# Altium schematic sheet Mainboard.SchDoc
size B
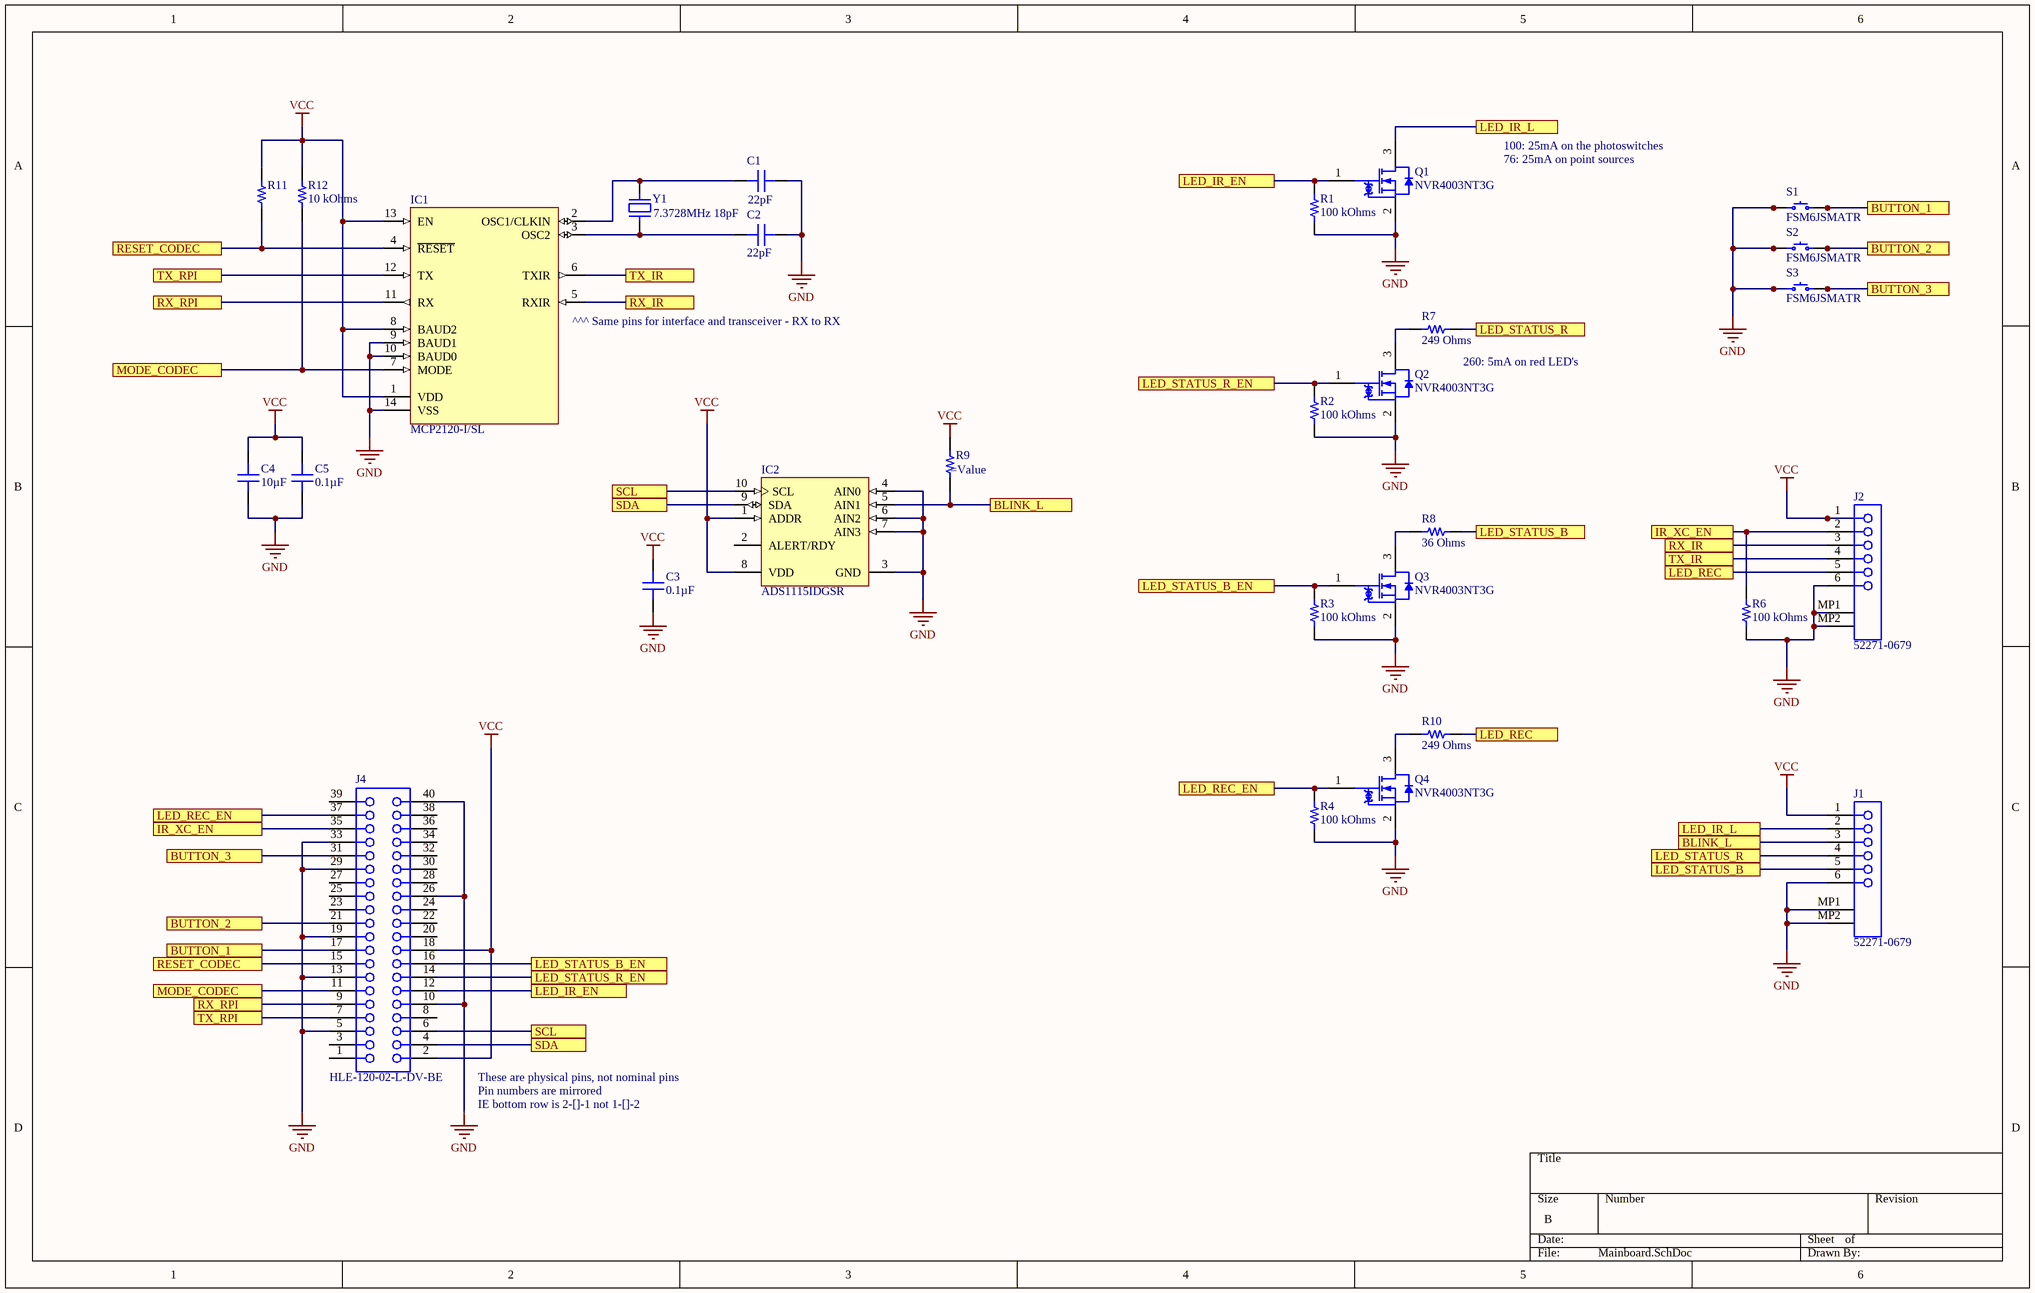
[diagram p0: Mainboard.SchDoc]

## Parts
C1  22pF  [CAP 0603_1608]
C2  22pF  [CAP 0603_1608]
C3  0.1µF  [CAP 0603_1608]
C4  10µF  [CAP 1206_3216 - 1.0MM]
C5  0.1µF  [CAP 0603_1608]
IC1  MCP2120-I/SL  [SOIC-SL14_N]
IC2  ADS1115IDGSR  [TI-DGS10_N]
J1  52271-0679  [MOLX-52271-0679]
J2  52271-0679  [MOLX-52271-0679]
J4  HLE-120-02-L-DV-BE  [SMTC-HLE-120-02-X-DV-BE]
Q1  NVR4003NT3G  [ONSC-SOT-23-3-318-08_V]
Q2  NVR4003NT3G  [ONSC-SOT-23-3-318-08_V]
Q3  NVR4003NT3G  [ONSC-SOT-23-3-318-08_V]
Q4  NVR4003NT3G  [ONSC-SOT-23-3-318-08_V]
R1  100 kOhms  [RES 0603_1608]
R2  100 kOhms  [RES 0603_1608]
R3  100 kOhms  [RES 0603_1608]
R4  100 kOhms  [RES 0603_1608]
R6  100 kOhms  [RES 0603_1608]
R7  249 Ohms  [RES 0603_1608]
R8  36 Ohms  [RES 0603_1608]
R9  (no value)  [RES 0603_1608]
R10  249 Ohms  [RES 0603_1608]
R11  (no value)  [RES 0603_1608]
R12  10 kOhms  [RES 0603_1608]
S1  FSM6JSMATR  [TE FSM6JSMA]
S2  FSM6JSMATR  [TE FSM6JSMA]
S3  FSM6JSMATR  [TE FSM6JSMA]
Y1  7.3728MHz 18pF  [HC-49 PTH]

## Ports
BLINK_L, BUTTON_1, BUTTON_2, BUTTON_3, IR_XC_EN, LED_IR_EN, LED_IR_L, LED_REC, LED_REC_EN, LED_STATUS_B, LED_STATUS_B_EN, LED_STATUS_R, LED_STATUS_R_EN, MODE_CODEC, RESET_CODEC, RX_IR, RX_RPI, SCL, SDA, TX_IR, TX_RPI

## Nets
GND: C1.2 C2.2 C3.1 C4.1 C5.1 IC1.9(BAUD1) IC1.10(BAUD0) IC1.14(VSS) IC2.3(GND) IC2.4(AIN0) IC2.6(AIN2) IC2.7(AIN3) J1.6 J1.MP1 J1.MP2 J2.6 J2.MP1 J2.MP2 J4.5 J4.10 J4.13 J4.19 J4.26 J4.29 J4.33 J4.40 Q1.2(S) Q2.2(S) Q3.2(S) Q4.2(S) R1.1 R2.1 R3.1 R4.1 R6.1 S1.1 S1.2 S2.1 S2.2 S3.1 S3.2
VCC: C3.2 C4.2 C5.2 IC1.1(VDD) IC1.8(BAUD2) IC1.13(EN) IC2.1(ADDR) IC2.8(VDD) J1.1 J2.1 J4.2 J4.18 R9.2 R11.2 R12.2
BLINK_L: IC2.5(AIN1) J1.3 R9.1 ; port BLINK_L
BUTTON_1: J4.17 S1.3 S1.4 ; port BUTTON_1
BUTTON_2: J4.21 S2.3 S2.4 ; port BUTTON_2
BUTTON_3: J4.31 S3.3 S3.4 ; port BUTTON_3
IR_XC_EN: J2.2 J4.35 R6.2 ; port IR_XC_EN
LED_IR_EN: J4.12 Q1.1(G) R1.2 ; port LED_IR_EN
LED_IR_L: J1.2 Q1.3(D) ; port LED_IR_L
LED_REC: J2.5 R10.2 ; port LED_REC
LED_REC_EN: J4.37 Q4.1(G) R4.2 ; port LED_REC_EN
LED_STATUS_B: J1.5 R8.2 ; port LED_STATUS_B
LED_STATUS_B_EN: J4.16 Q3.1(G) R3.2 ; port LED_STATUS_B_EN
LED_STATUS_R: J1.4 R7.2 ; port LED_STATUS_R
LED_STATUS_R_EN: J4.14 Q2.1(G) R2.2 ; port LED_STATUS_R_EN
MODE_CODEC: IC1.7(MODE) J4.11 R12.1 ; port MODE_CODEC
RESET_CODEC: IC1.4(~{RESET}) J4.15 R11.1 ; port RESET_CODEC
RX_IR: IC1.5(RXIR) J2.3 ; port RX_IR
RX_RPI: IC1.11(RX) J4.9 ; port RX_RPI
SCL: IC2.10(SCL) J4.6 ; port SCL
SDA: IC2.9(SDA) J4.4 ; port SDA
TX_IR: IC1.6(TXIR) J2.4 ; port TX_IR
TX_RPI: IC1.12(TX) J4.7 ; port TX_RPI
NetC1_1: C1.1 IC1.2(OSC1/CLKIN) Y1.2
NetC2_1: C2.1 IC1.3(OSC2) Y1.1
NetQ2_3: Q2.3(D) R7.1
NetQ3_3: Q3.3(D) R8.1
NetQ4_3: Q4.3(D) R10.1

Not connected (* = marked no-connect by the designer): IC2 2(ALERT/RDY); J4 1 3 8 20 22 23 24 25 27 28 30 32 34 36 38 39

## Notes on the sheet
- 100: 25mA on the photoswitches
- 76: 25mA on point sources
- (near IC1) ^^^ Same pins for interface and transceiver - RX to RX
- (near R7) 260: 5mA on red LED's
- These are physical pins, not nominal pins
- Pin numbers are mirrored
- IE bottom row is 2-[]-1 not 1-[]-2

## Library data of the parts
C1 C2 = 885012006019: CAP CER 22PF 16V C0G/NP0 0603; Manufacturer: Würth Elektronik; Temperature Coefficient: C0G, NP0; Tolerance: ±5%; Part Number: 885012006019; Value: 22pF; Applications: General Purpose; Capacitance: 22pF; ComponentLink1Description: Datasheet; ComponentLink1URL: https://katalog.we-online.de/pbs/datasheet/885012006019.pdf; ComponentLink2Description: DigiKey Link; ComponentLink2URL: http://digikey.com/product-detail/en/w-rth-elektronik/885012006019/732-7762-1-ND/5454389; Device Package: 0603 (1608 Metric); LastUpdated: 1/21/2020 12:01:39 AM; Lifecycle Status: Active; Minimum Order: 1; Mounting Type: Surface Mount, MLCC; Operating Temperature: -55°C ~ 125°C; Package / Case: 0603 (1608 Metric); Packaging: TapeAndReel; PartId: 17577; Part Status: Active; Price: 0.02; Series: WCAP-CSGP; Size / Dimension: 0.063" L x 0.031" W (1.60mm x 0.80mm); Supplier 1: DigiKey; Supplier Part Number 1: 732-7762-1-ND; Thickness (Max): 0.034" (0.87mm); Voltage - Rated: 16V
C3 C5 = C0603C104K5RAC7411: CAP CER 0.1UF 50V X7R 0603; Manufacturer: KEMET; Tolerance: ±10%; Part Number: C0603C104K5RAC7411; Value: 0.1µF; Applications: Bypass, Decoupling; Capacitance: 0.1µF; ComponentLink1Description: Datasheet; ComponentLink1URL: https://api.kemet.com/component-edge/download/datasheet/C0603C104K5RAC7411.pdf; ComponentLink2Description: DigiKey Link; ComponentLink2URL: http://digikey.com/product-detail/en/kemet/C0603C104K5RAC7411/399-7374-2-ND/3317013; Device Package: 0603 (1608 Metric); LastUpdated: 1/21/2020 12:02:09 AM; Lifecycle Status: Active; Minimum Order: 15000; Mounting Type: Surface Mount, MLCC; Operating Temperature: -55°C ~ 125°C; Package / Case: 0603 (1608 Metric); Packaging: TapeAndReel; PartId: 2233; Part Status: Active; Price: 0.02; Series: SMD Comm X7R; Size / Dimension: 0.063" L x 0.031" W (1.60mm x 0.80mm); Supplier 1: DigiKey; Supplier Part Number 1: 399-7374-2-ND; Temperature Coefficient: X7R; Thickness (Max): 0.035" (0.90mm); Voltage - Rated: 50V
C4 = EMK316BJ106MD-T: CAP CER 10UF 16V X5R 1206; Manufacturer: Taiyo Yuden; Tolerance: ±20%; Part Number: EMK316BJ106MD-T; Value: 10µF; Applications: General Purpose; Capacitance: 10µF; ComponentLink1Description: Datasheet; ComponentLink1URL: http://www.yuden.co.jp/productdata/catalog/mlcc06_e.pdf; ComponentLink2Description: DigiKey Link; ComponentLink2URL: http://digikey.com/product-detail/en/taiyo-yuden/EMK316BJ106MD-T/587-4881-1-ND/6563724; Device Package: 1206 (3216 Metric); LastUpdated: 1/21/2020 12:03:23 AM; Lifecycle Status: Active; Minimum Order: 1; Mounting Type: Surface Mount, MLCC; Operating Temperature: -55°C ~ 85°C; Package / Case: 1206 (3216 Metric); Packaging: TapeAndReel; PartId: 18996; Part Status: Active; Price: 0.05; Series: M; Size / Dimension: 0.126" L x 0.063" W (3.20mm x 1.60mm); Supplier 1: DigiKey; Supplier Part Number 1: 587-4881-1-ND; Temperature Coefficient: X5R; Thickness (Max): 0.037" (0.95mm); Voltage - Rated: 16V
IC1 = MCP2120-I/SL: Infrared Encoder/Decoder, 14-Pin SOIC, Industrial Temperature; Manufacturer: Microchip; DatasheetVersion: revB, Feb-2007; PackageVersion: revBB, Aug-2009; PackageReference: SOIC-SL14; PackageDescription: 14-Lead Plastic Small Outline (SL) - Narrow, 3.90mm Body [SOIC]; Supplier 1: Digi-Key; Supplier Part Number 1: MCP2120-I/SL-ND; Supplier 2: Farnell; Supplier Part Number 2: 1084305; Supplier 3: Newark; Supplier Part Number 3: 33C0867; Supplier 4: Mouser; Supplier Part Number 4: 579-MCP2120ISL; Mounting Technology: Surface Mount; Code_JEDEC: MS-012-AB; Code_IPC: SOIC127P600-14; PartNumber: MCP2120-I/SL; ComponentLink1Description: Manufacturer URL; ComponentLink1URL: http://www.microchip.com/; ComponentLink2Description: Datasheet; ComponentLink2URL: http://ww1.microchip.com/downloads/en/DeviceDoc/21618b.pdf; ComponentLink3Description: Package Specification; ComponentLink3URL: http://www.microchip.com/stellent/groups/techpub_sg/documents/packagingspec/en012702.pdf
IC2 = ADS1115IDGSR: 16-Bit ADC with Integrated Multiplexer, PGA, Comparator, Oscillator, and Reference, -40 to 125 degC, 10-pin SOP (DGS10), Green (RoHS & no Sb/Br); Manufacturer: Texas Instruments; # Input Channels: 4; Analog Voltage AV/DD(Max)(V): 5.5; Analog Voltage AV/DD(Min)(V): 2; Architecture: Delta-Sigma; INL(Max)(+/-LSB): 1; Interface: Serial I2C; Resolution(Bits): 16; Sample Rate (max)(SPS): 860; SubFamily: Precision ADC (<=10MSPS); DatasheetVersion: SBAS444B; PackageVersion: 4073272/C, 02/2004; PackageReference: DGS10; PackageDescription: 10-Pin Plastic Small Outline, Body 3 x 3 mm, Pitch 0.5 mm; Supplier 1: Digi-Key; Supplier Part Number 1: 296-13060-2-ND; Supplier 2: Digi-Key; Supplier Part Number 2: 296-13060-1-ND; Supplier 3: Digi-Key; Supplier Part Number 3: 296-13060-6-ND; Supplier 4: Newark; Supplier Part Number 4: 74C7007; Supplier 5: Mouser; Supplier Part Number 5: 595-ADS1253E/2K5; Digital Supply(Max)(V): 5.5; Digital Supply(Min)(V): 2; Eco-Plan: Green (RoHS & no Sb/Br); Mounting Technology: Surface Mount; Code_JEDEC: MO-153; PartNumber: ADS1115IDGSR; ComponentLink1Description: Manufacturer URL; ComponentLink1URL: http://www.ti.com/; ComponentLink2Description: Datasheet; ComponentLink2URL: http://www.ti.com/general/docs/lit/getliterature.tsp?genericPartNumber=ADS1115&fileType=pdf; ComponentLink3Description: Package Specification; ComponentLink3URL: http://www.ti.com/lit/ml/mpds035b/mpds035b.pdf
J1 J2 = 52271-0679: 1.0 mm Pitch Easy-On(TM) Type FPC Connector, 3.0 mm Mated Height, Right Angle, ZIF, SMT, Bottom Contact, 6 Circuits, -40 to 85 degC, ELV and RoHS Compliant, Tape and Reel; Manufacturer: Molex; Circuits (Loaded): 6; Current (Max per Contact): 0.5A; Durability (mating cycles max): 30; Entry Angle: 90degrees Angle; Mated Height: 3.00mm; Material - Metal: Phosphor Bronze; Material - Plating Mating: Tin-Bismuth; PCB Locator: No; PCB Retention: Yes; Pitch - Mating Interface: 1.00mm; Voltage (Max): 50V AC (RMS)/DC; PackageVersion: Rev. B, 04/2004; PackageReference: 52271-0679; PackageDescription: 6-Lead FPC Connector, Pitch 1.0 mm; Supplier 1: Farnell; Supplier Part Number 1: 1079950; Supplier 2: Newark; Supplier Part Number 2: 58J9529; Supplier 3: Mouser; Supplier Part Number 3: 538-52271-0679; Contact Position: Bottom; Material - Plating Termination: Tin-Bismuth; Number of Rows: 1; Orientation: Right Angle; Packing: Tape and Reel; Pitch - Termination Interface: 1.00mm; Polarized to PCB: Yes; RoHS: TRUE; Stackable: No; Mounting Technology: Surface Mount; PartNumber: 52271-0679; ComponentLink1Description: Manufacturer URL; ComponentLink1URL: http://www.molex.com/molex/index.jsp; ComponentLink2Description: Datasheet; ComponentLink2URL: http://www.molex.com/webdocs/datasheets/pdf/en-us/0522710679_FFC_FPC_CONNECTORS.pdf; ComponentLink3Description: Package Specification; ComponentLink3URL: http://www.molex.com/pdm_docs/sd/522710679_sd.pdf; System: Connector
J4 = HLE-120-02-L-DV-BE: Cost-Effective Reliable Socket, Surface Mount, Vertical, -55 to 125 degC, 2.54 mm Pitch, 40-Pin, Female, RoHS; Manufacturer: Samtec; Pitch: 2.54 mm; DatasheetVersion: F-214; PackageVersion: AQ, 12/1998; PackageReference: HLE-120-02-X-DV-BE; PackageDescription: .100 Tiger Beam Socket Assembly; Orientation: Vertical; RoHS: True; Temperature Range: -55 to 125 degC; Mounting Technology: Surface Mount; PartNumber: HLE-120-02-L-DV-BE; ComponentLink1Description: Manufacturer URL; ComponentLink1URL: http://www.samtec.com; ComponentLink2Description: Datasheet; ComponentLink2URL: http://www.samtec.com/documents/webfiles/pdf/HLE.PDF; ComponentLink3Description: Package Specification; ComponentLink3URL: http://www.samtec.com/documents/webfiles/cpdf/HLE-1XX-02-XXX-DV-XX-XX-XX-MKT.pdf
Q1-Q4 = NVR4003NT3G: Small Signal MOSFET, 30 V, 0.56 A, Single N-Channel, 3-Pin SOT-23, Pb-Free, Tape and Reel; Manufacturer: On Semiconductor; Channel Polarity: N Channel; Ciss Typ (pF): 21; Coss Typ (pF): 19.7; Crss Typ (pF): 8.1; ID Max (A): 0.56; V(BR)DSS Min (V): 30; VGS Max (V): 20; VGS(th) Max (V): 1.4; DatasheetVersion: Rev. 3; PackageVersion: Rev. AP, 11/2009; PackageReference: SOT-23-3-318-08; PackageDescription: 3-Pin Small Outline Transistor, Body 2.92 x 1.3 mm, Pitch 0.95 mm; Supplier 1: Digi-Key; Supplier Part Number 1: NVR4003NT3G-ND; Supplier 2: Newark; Supplier Part Number 2: 76T6792; Supplier 3: Mouser; Supplier Part Number 3: 863-NVR4003NT3G; Configuration: Single; Package Type: SOT-23-3; Packing: Tape and Reel; RoHS: Pb-Free; Mounting Technology: Surface Mount; PartNumber: NVR4003NT3G; ComponentLink1Description: Manufacturer URL; ComponentLink1URL: http://www.onsemi.com/; ComponentLink2Description: Datasheet; ComponentLink2URL: http://www.onsemi.cn/pub_link/Collateral/NTR4003N-D.PDF; ComponentLink3Description: Package Specification; ComponentLink3URL: http://www.onsemi.cn/pub_link/Collateral/318-08.PDF
R1-R4 R6 = CPF0603B100KE: RES SMD 100K OHM 0.1% 1/16W 0603; Manufacturer: TE Connectivity Passive Product; Power (Watts): 0.063W, 1/16W; Temperature Coefficient: ±25ppm/°C; Part Number: CPF0603B100KE; Value: 100 kOhms; ComponentLink1Description: Datasheet; ComponentLink1URL: https://www.te.com/commerce/DocumentDelivery/DDEController?Action=srchrtrv&DocNm=1773200&DocType=DS&DocLang=English; ComponentLink2Description: DigiKey Link; ComponentLink2URL: http://digikey.com/product-detail/en/te-connectivity-passive-product/CPF0603B100KE/A119912CT-ND/4966510; Composition: Thin Film; Device Package: 0603 (1608 Metric); Height - Seated (Max): 0.022" (0.55mm); LastUpdated: 1/21/2020 12:24:55 AM; Lifecycle Status: Active; Minimum Order: 1; Number of Terminations: 2; Operating Temperature: -55°C ~ 155°C; Package / Case: 0603 (1608 Metric); Packaging: TapeAndReel; PartId: 4883; Part Status: Active; Price: 0.09; Resistance: 100 kOhms; Series: CPF, Neohm; Size / Dimension: 0.061" L x 0.031" W (1.55mm x 0.80mm); Supplier 1: DigiKey; Supplier Part Number 1: A119912CT-ND; Supplier Device Package: 0603; Tolerance: ±0.1%
R7 R10 = ERJ-3EKF2490V: RES SMD 249 OHM 1% 1/10W 0603; Manufacturer: Panasonic Electronic Components; Power (Watts): 0.1W, 1/10W; Temperature Coefficient: ±100ppm/°C; Part Number: ERJ-3EKF2490V; Value: 249 Ohms; ComponentLink1Description: Datasheet; ComponentLink1URL: https://industrial.panasonic.com/cdbs/www-data/pdf/RDA0000/AOA0000C304.pdf; ComponentLink2Description: DigiKey Link; ComponentLink2URL: http://digikey.com/product-detail/en/panasonic-electronic-components/ERJ-3EKF2490V/P249HCT-ND/198274; Composition: Thick Film; Device Package: 0603 (1608 Metric); Features: Automotive AEC-Q200; Height - Seated (Max): 0.022" (0.55mm); LastUpdated: 1/21/2020 12:14:40 AM; Lifecycle Status: Active; Minimum Order: 1; Number of Terminations: 2; Operating Temperature: -55°C ~ 155°C; Package / Case: 0603 (1608 Metric); Packaging: TapeAndReel; PartId: 26079; Part Status: Active; Price: 0.01; Ratings: AEC-Q200; Resistance: 249 Ohms; Series: ERJ; Size / Dimension: 0.063" L x 0.031" W (1.60mm x 0.80mm); Supplier 1: DigiKey; Supplier Part Number 1: P249HCT-ND; Supplier Device Package: 0603; Tolerance: ±1%
R8 = RK73H1JTTD36R0F: RES 36 OHM 1% 1/8W 0603; Manufacturer: KOA Speer Electronics, Inc.; Power (Watts): 0.125W, 1/8W; Temperature Coefficient: ±100ppm/°C; Part Number: RK73H1JTTD36R0F; Value: 36 Ohms; ComponentLink1Description: Datasheet; ComponentLink1URL: http://www.koaspeer.com/catimages/Products/RK73H/RK73H.pdf; ComponentLink2Description: DigiKey Link; ComponentLink2URL: http://digikey.com/product-detail/en/koa-speer-electronics-inc/RK73H1JTTD36R0F/2019-RK73H1JTTD36R0FCT-ND/9847473; Composition: Thick Film; Device Package: 0603 (1608 Metric); Features: Automotive AEC-Q200, Moisture Resistant; Height - Seated (Max): 0.022" (0.55mm); LastUpdated: 1/21/2020 12:23:23 AM; Lifecycle Status: Active; Minimum Order: 1; Number of Terminations: 2; Operating Temperature: -55°C ~ 155°C; Package / Case: 0603 (1608 Metric); Packaging: CutTape; PartId: 8854; Part Status: Active; Price: 0.10; Ratings: AEC-Q200; Resistance: 36 Ohms; Series: RK73H; Size / Dimension: 0.063" L x 0.031" W (1.60mm x 0.80mm); Supplier 1: DigiKey; Supplier Part Number 1: 2019-RK73H1JTTD36R0FCT-ND; Supplier Device Package: 0603; Tolerance: ±1%
R9 R11 = RNCS0603BKE10K0: RES 10K OHM 0.1% 1/16W 0603; Manufacturer: Stackpole Electronics Inc; Power (Watts): 0.063W, 1/16W; Resistance: 10 kOhms; Temperature Coefficient: ±25ppm/°C; Part Number: RNCS0603BKE10K0; ComponentLink1Description: Datasheet; ComponentLink1URL: https://www.seielect.com/catalog/sei-rncs_rnch.pdf; ComponentLink2Description: DigiKey Link; ComponentLink2URL: http://digikey.com/product-detail/en/stackpole-electronics-inc/RNCS0603BKE10K0/RNCS0603BKE10K0CT-ND/1800113; Composition: Thin Film; Device Package: 0603 (1608 Metric); Features: Anti-Corrosive, Automotive AEC-Q200, Moisture Resistant; Height - Seated (Max): 0.022" (0.55mm); LastUpdated: 1/21/2020 12:25:01 AM; Lifecycle Status: Active; Minimum Order: 1; Number of Terminations: 2; Operating Temperature: -55°C ~ 155°C; Package / Case: 0603 (1608 Metric); Packaging: TapeAndReel; PartId: 4838; Part Status: Active; Price: 0.08; Ratings: AEC-Q200; Series: RNCS; Size / Dimension: 0.061" L x 0.031" W (1.55mm x 0.80mm); Supplier 1: DigiKey; Supplier Part Number 1: RNCS0603BKE10K0CT-ND; Supplier Device Package: 0603; Tolerance: ±0.1%
R12 = RNCS0603BKE10K0: RES 10K OHM 0.1% 1/16W 0603; Manufacturer: Stackpole Electronics Inc; Power (Watts): 0.063W, 1/16W; Temperature Coefficient: ±25ppm/°C; Part Number: RNCS0603BKE10K0; Value: 10 kOhms; ComponentLink1Description: Datasheet; ComponentLink1URL: https://www.seielect.com/catalog/sei-rncs_rnch.pdf; ComponentLink2Description: DigiKey Link; ComponentLink2URL: http://digikey.com/product-detail/en/stackpole-electronics-inc/RNCS0603BKE10K0/RNCS0603BKE10K0CT-ND/1800113; Composition: Thin Film; Device Package: 0603 (1608 Metric); Features: Anti-Corrosive, Automotive AEC-Q200, Moisture Resistant; Height - Seated (Max): 0.022" (0.55mm); LastUpdated: 1/21/2020 12:25:01 AM; Lifecycle Status: Active; Minimum Order: 1; Number of Terminations: 2; Operating Temperature: -55°C ~ 155°C; Package / Case: 0603 (1608 Metric); Packaging: TapeAndReel; PartId: 4838; Part Status: Active; Price: 0.08; Ratings: AEC-Q200; Resistance: 10 kOhms; Series: RNCS; Size / Dimension: 0.061" L x 0.031" W (1.55mm x 0.80mm); Supplier 1: DigiKey; Supplier Part Number 1: RNCS0603BKE10K0CT-ND; Supplier Device Package: 0603; Tolerance: ±0.1%
S1-S3 = FSM6JSMATR: SWITCH TACTILE SPST-NO 0.05A 24V; Manufacturer: TE Connectivity ALCOSWITCH Switches; Actuator Height off PCB, Vertical: 7.00mm; Actuator Orientation: Top Actuated; Actuator Type: Standard; Contact Rating @ Voltage: 0.05A @ 24VDC; Illumination: Non-Illuminated; Operating Force: 160gf; Outline: 6.00mm x 6.00mm; Switch Function: Off-Mom; Part Number: FSM6JSMATR; Circuit: SPST-NO; ComponentLink1Description: Datasheet; ComponentLink1URL: https://www.te.com/commerce/DocumentDelivery/DDEController?Action=srchrtrv&DocNm=1308111-1_SWITCHES_CORE_PROGRAM_CATALOG&DocType=CS&DocLang=English; ComponentLink2Description: DigiKey Link; ComponentLink2URL: http://digikey.com/product-detail/en/te-connectivity-alcoswitch-switches/FSM6JSMATR/450-2058-1-ND/4569748; LastUpdated: 2/4/2020 2:39:39 PM; Lifecycle Status: Active; Minimum Order: 1; Mounting Type: Surface Mount; Operating Temperature: -35°C ~ 85°C; Packaging: TapeAndReel; Part Status: Active; Price: 0.25; Series: FSMJSMA; Supplier 1: DigiKey; Supplier Part Number 1: 450-2058-1-ND; Termination Style: Gull Wing
Y1 = Xtal: Standard crystal